# Altium schematic sheet PT100检测电路.SchDoc
size A4
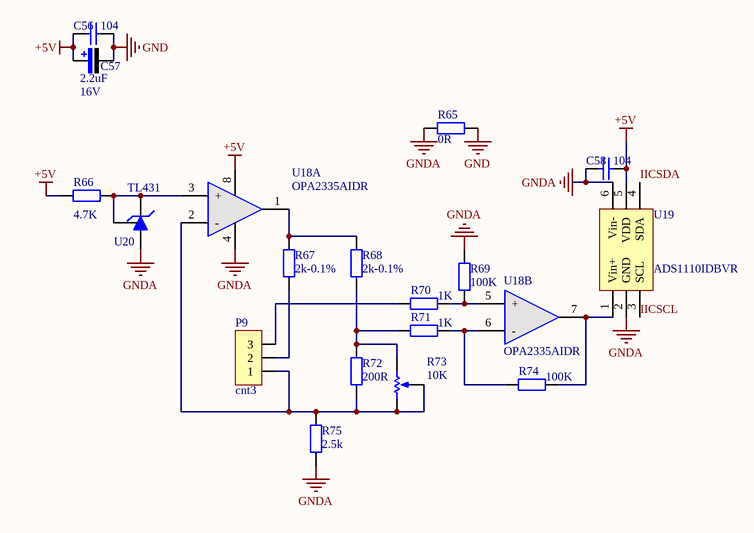
[diagram p0: PT100检测电路.SchDoc]

## Parts
C56  value 104  [C-RAD-0603]  (hidden comment: Cap)
C57  value 2.2uF  Vol: 16V  [CAP-3216]  (hidden comment: Cap Pol)
C58  value 104  [C-RAD-0603]  (hidden comment: Cap)
P9  cnt3  [7.62mmPCB接线端子3p]
R65  value 0R  [0603-1]  (hidden comment: Res1)
R66  value 4.7K  [0603-1]  (hidden comment: Res1)
R67  value 2k-0.1%  [0603-1]  (hidden comment: Res1)
R68  value 2k-0.1%  [0603-1]  (hidden comment: Res1)
R69  value 100K  [0603-1]  (hidden comment: Res1)
R70  value 1K  [0603-1]  (hidden comment: Res1)
R71  value 1K  [0603-1]  (hidden comment: Res1)
R72  value 200R  [0603-1]  (hidden comment: Res1)
R73  value 10K  [VR-3266W]  (hidden comment: RPot)
R74  value 100K  [0603-1]  (hidden comment: Res1)
R75  value 2.5k  [0603-1]  (hidden comment: Res1)
U18  OPA2335AIDR  [NSO8_N]  (parts A,B of 2)
U19  ADS1110IDBVR  [SOT23-6]
U20  TL431  [SOT23]

## Nets
+5V: C56.1 C57.1 C58.2 R66.1 U18.8(V+) U19.5(VDD)
GND: C56.2 C57.2 R65.1
GNDA: C58.1 R65.2 R69.2 R75.1 U18.4(V-) U19.2(GND) U19.6(Vin-) U20.3
IICSCL: U19.3(SCL)
IICSDA: U19.4(SDA)
NetP9_1: P9.1 R72.1 R73.1(TOP) R73.2(TAP) R75.2 U18.2(-)
NetP9_2: P9.2 R67.1
NetP9_3: P9.3 R70.1
NetR66_2: R66.2 U18.3(+) U20.1 U20.2
NetR67_2: R67.2 R68.2 U18.1(OUT1)
NetR68_1: R68.1 R71.1 R72.2 R73.3(BOT)
NetR69_1: R69.1 R70.2 U18.5(+)
NetR71_2: R71.2 R74.1 U18.6(-)
NetR74_2: R74.2 U18.7(OUT2) U19.1(Vin+)

## Library data of the parts
C56 C58 = Cap: 无极性电容; Published: 8-Jun-2000; LatestRevisionDate: 17-Jul-2002; LatestRevisionNote: Re-released for DXP Platform.; PackageReference: RAD-0.3; Publisher: Altium Limited
C57 = Cap Pol: 极性电解电容; Published: 8-Jun-2000; LatestRevisionDate: 17-Jul-2002; LatestRevisionNote: Re-released for DXP Platform.; PackageReference: RB7.6-15; Publisher: Altium Limited
P9 = cnt3: 3p接线端子
R65-R72 R74 R75 = Res1: 贴片电阻; Published: 8-Jun-2000; LatestRevisionDate: 17-Jul-2002; LatestRevisionNote: Re-released for DXP Platform.; PackageReference: AXIAL-0.4; Publisher: Altium Limited
R73 = RPot: 精密可调电阻; Sim Note: Enter the Resistance value and the set point into parameter fields.; Set Position: 0.5; Published: 8-Jun-2000; LatestRevisionDate: 17-Jul-2002; LatestRevisionNote: Re-released for DXP Platform.; PackageReference: VR5; Publisher: Altium Limited
U18 = AD8667: 双运放
U19 = ADS1110IDBVR: 16位内部基准AD芯片IIC